# Altium project SVPXFMC_Carrier_3U.PrjPcb (part 2 of 7)

## Sheet FPGA_Misc.SchDoc: SVPXFMC Carrier 3U
size 420 x 297 mm; CheckedBy: \; Author: G.Kasprowicz; CompanyName: ISE; DrawnBy: T.Przywozki; Organization: WUT ISE; Address1: Warsaw University of Technology; Address2: Nowowiejska 15/19 00-665 Warsaw; Revision: 1.0.; SheetNumber: 18; SheetTotal: 20; Project: SVPXFMC Carrier 3U; ModifiedBy: -; CheckedDate: -; Title2: FPGA Misc; DivGrp: ISE; Designer: G. Kasprowicz
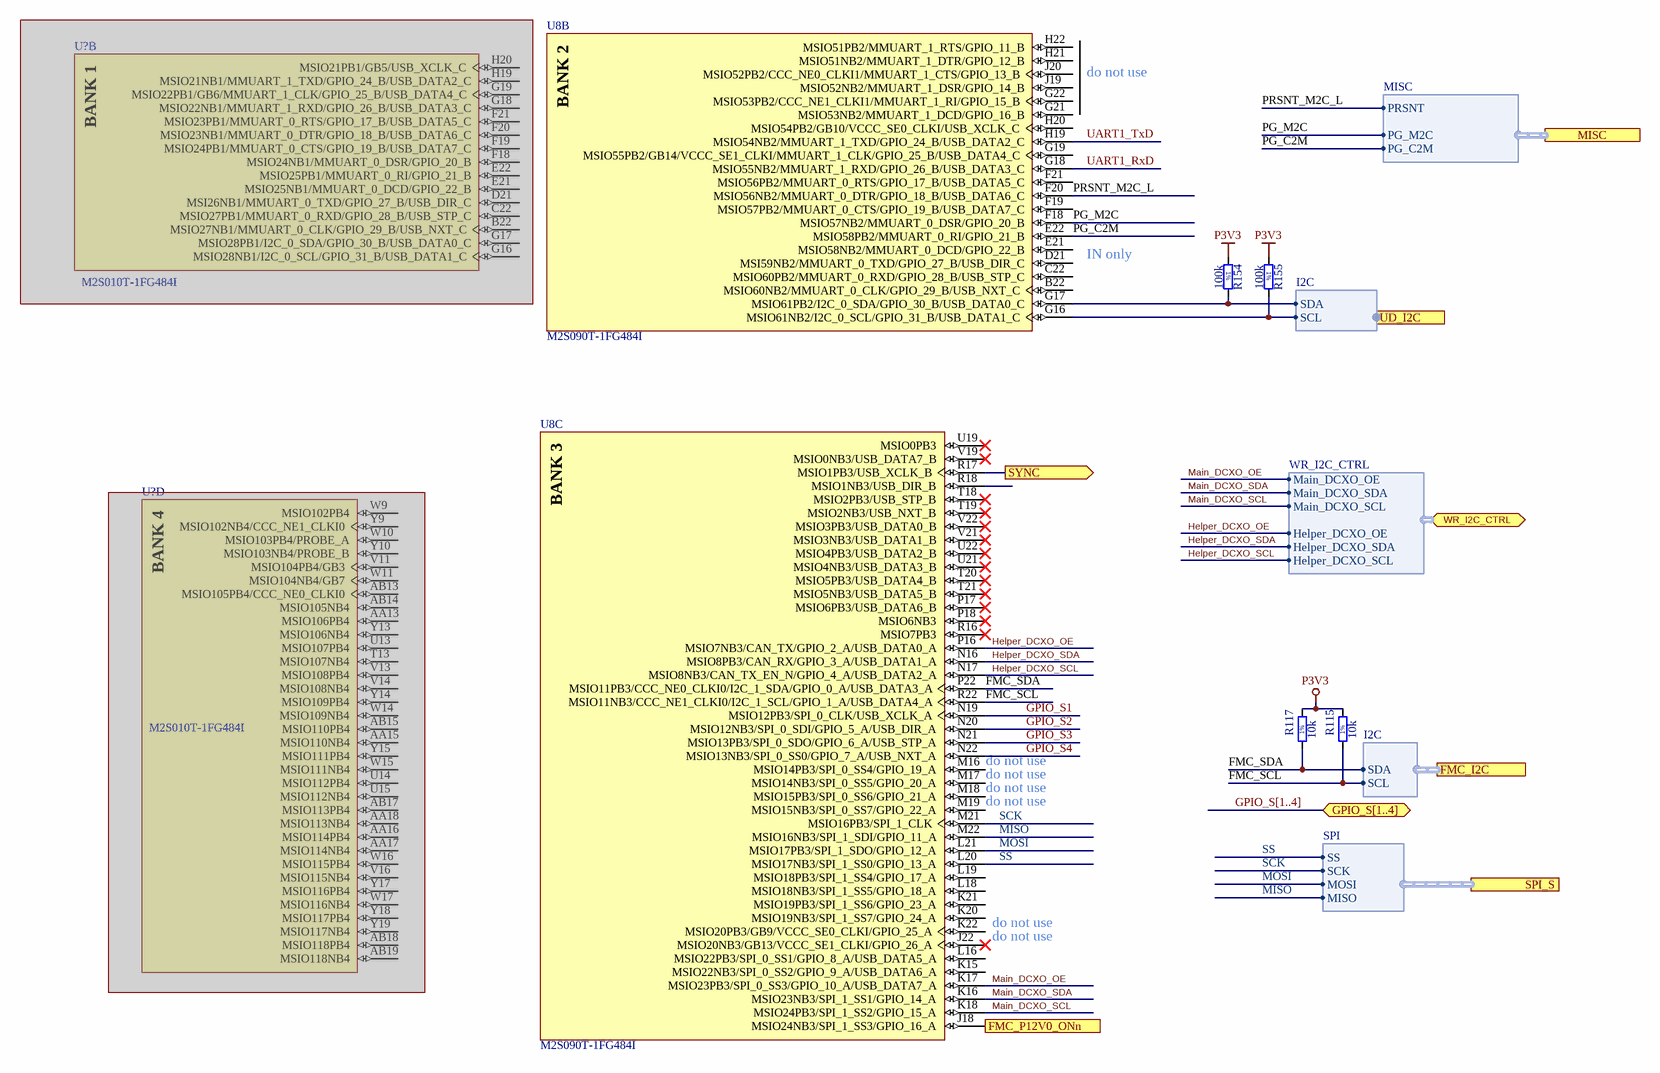
[diagram p4: FPGA_Misc.SchDoc]

### Parts
(Parts that share a designator on the sheet are numbered #1, #2 ... from top to bottom, then left to right.)
R115  10k  [RESC1005X40N]
R117  10k  [RESC1005X40N]
R154  100k  [RESC1005X40N]
R155  100k  [RESC1005X40N]
U8  M2S090T-1FG484I  [MCSM-FG-484_V]  (parts B,C of 15)
U?#3  M2S010T-1FG484I  [MCSM-FG-484_V]  (part B of 16)  (masked out: inside a compile mask, not in the netlist)
U?#4  M2S010T-1FG484I  [MCSM-FG-484_V]  (part D of 16)  (masked out: inside a compile mask, not in the netlist)

### Ports
FMC_I2C (harness I2C), FMC_P12V0_ONn (out), GPIO_S[1..4] (bidir), MISC (harness MISC), SPI_S (harness SPI), SYNC (out), UD_I2C (harness I2C), WR_I2C_CTRL (bidir, harness WR_I2C_CTRL)

### Harnesses
I2C: SCL, SDA
MISC: PRSNT, PG_M2C, PG_C2M
SPI: MISO, MOSI, SCK, SS
WR_I2C_CTRL: Main_DCXO_OE, Main_DCXO_SDA, Main_DCXO_SCL, Helper_DCXO_OE, Helper_DCXO_SDA, Helper_DCXO_SCL
I2C: SDA, SCL

### Nets
P3V3: R115.2 R117.2 R154.1 R155.1
FMC_P12V0_ONn: U8.J18(MSIO24NB3/SPI_1_SS3/GPIO_16_A) ; port FMC_P12V0_ONn
FMC_SCL: R115.1 U8.R22(MSIO11NB3/CCC_NE1_CLKI0/I2C_1_SCL/GPIO_1_A/USB_DATA4_A) ; port FMC_I2C.SCL
FMC_SDA: R117.1 U8.P22(MSIO11PB3/CCC_NE0_CLKI0/I2C_1_SDA/GPIO_0_A/USB_DATA3_A) ; port FMC_I2C.SDA
GPIO_S1: U8.N19(MSIO12PB3/SPI_0_CLK/USB_XCLK_A)
GPIO_S2: U8.N20(MSIO12NB3/SPI_0_SDI/GPIO_5_A/USB_DIR_A)
GPIO_S3: U8.N21(MSIO13PB3/SPI_0_SDO/GPIO_6_A/USB_STP_A)
GPIO_S4: U8.N22(MSIO13NB3/SPI_0_SS0/GPIO_7_A/USB_NXT_A)
Helper_DCXO_OE: U8.P16(MSIO7NB3/CAN_TX/GPIO_2_A/USB_DATA0_A) ; port WR_I2C_CTRL.Helper_DCXO_OE
Helper_DCXO_SCL: U8.N17(MSIO8NB3/CAN_TX_EN_N/GPIO_4_A/USB_DATA2_A) ; port WR_I2C_CTRL.Helper_DCXO_SCL
Helper_DCXO_SDA: U8.N16(MSIO8PB3/CAN_RX/GPIO_3_A/USB_DATA1_A) ; port WR_I2C_CTRL.Helper_DCXO_SDA
Main_DCXO_OE: U8.K17(MSIO23PB3/SPI_0_SS3/GPIO_10_A/USB_DATA7_A) ; port WR_I2C_CTRL.Main_DCXO_OE
Main_DCXO_SCL: U8.K18(MSIO24PB3/SPI_1_SS2/GPIO_15_A) ; port WR_I2C_CTRL.Main_DCXO_SCL
Main_DCXO_SDA: U8.K16(MSIO23NB3/SPI_1_SS1/GPIO_14_A) ; port WR_I2C_CTRL.Main_DCXO_SDA
MISO: U8.M22(MSIO16NB3/SPI_1_SDI/GPIO_11_A) ; port SPI_S.MISO
MOSI: U8.L21(MSIO17PB3/SPI_1_SDO/GPIO_12_A) ; port SPI_S.MOSI
PG_C2M: U8.E22(MSIO58PB2/MMUART_0_RI/GPIO_21_B) ; port MISC.PG_C2M
PG_M2C: U8.F18(MSIO57NB2/MMUART_0_DSR/GPIO_20_B) ; port MISC.PG_M2C
PRSNT_M2C_L: U8.F20(MSIO56NB2/MMUART_0_DTR/GPIO_18_B/USB_DATA6_C) ; port MISC.PRSNT
SCK: U8.M21(MSIO16PB3/SPI_1_CLK) ; port SPI_S.SCK
SS: U8.L20(MSIO17NB3/SPI_1_SS0/GPIO_13_A) ; port SPI_S.SS
SYNC: U8.R17(MSIO1PB3/USB_XCLK_B) ; port SYNC
UART1_RxD: U8.G18(MSIO55NB2/MMUART_1_RXD/GPIO_26_B/USB_DATA3_C)  [project net UART1_RxD_18]
UART1_TxD: U8.H19(MSIO54NB2/MMUART_1_TXD/GPIO_24_B/USB_DATA2_C)  [project net UART1_TxD_18]
NetR152_2: R154.2 U8.G17(MSIO61PB2/I2C_0_SDA/GPIO_30_B/USB_DATA0_C) ; port UD_I2C.SDA
NetR153_2: R155.2 U8.G16(MSIO61NB2/I2C_0_SCL/GPIO_31_B/USB_DATA1_C) ; port UD_I2C.SCL

Not connected (* = marked no-connect by the designer): U8 B22(MSIO60NB2/MMUART_0_CLK/GPIO_29_B/USB_NXT_C) C22(MSIO60PB2/MMUART_0_RXD/GPIO_28_B/USB_STP_C) D21(MSI59NB2/MMUART_0_TXD/GPIO_27_B/USB_DIR_C) E21(MSIO58NB2/MMUART_0_DCD/GPIO_22_B) F19(MSIO57PB2/MMUART_0_CTS/GPIO_19_B/USB_DATA7_C) F21(MSIO56PB2/MMUART_0_RTS/GPIO_17_B/USB_DATA5_C) G19(MSIO55PB2/GB14/VCCC_SE1_CLKI/MMUART_1_CLK/GPIO_25_B/USB_DATA4_C) G21(MSIO53NB2/MMUART_1_DCD/GPIO_16_B) G22(MSIO53PB2/CCC_NE1_CLKI1/MMUART_1_RI/GPIO_15_B) H20(MSIO54PB2/GB10/VCCC_SE0_CLKI/USB_XCLK_C) H21(MSIO51NB2/MMUART_1_DTR/GPIO_12_B) H22(MSIO51PB2/MMUART_1_RTS/GPIO_11_B) J19(MSIO52NB2/MMUART_1_DSR/GPIO_14_B) J20(MSIO52PB2/CCC_NE0_CLKI1/MMUART_1_CTS/GPIO_13_B) J22(MSIO20NB3/GB13/VCCC_SE1_CLKI/GPIO_26_A)* K15(MSIO22NB3/SPI_0_SS2/GPIO_9_A/USB_DATA6_A) K20(MSIO19NB3/SPI_1_SS7/GPIO_24_A) K21(MSIO19PB3/SPI_1_SS6/GPIO_23_A) K22(MSIO20PB3/GB9/VCCC_SE0_CLKI/GPIO_25_A) L16(MSIO22PB3/SPI_0_SS1/GPIO_8_A/USB_DATA5_A) L18(MSIO18NB3/SPI_1_SS5/GPIO_18_A) L19(MSIO18PB3/SPI_1_SS4/GPIO_17_A) M16(MSIO14PB3/SPI_0_SS4/GPIO_19_A) M17(MSIO14NB3/SPI_0_SS5/GPIO_20_A) M18(MSIO15PB3/SPI_0_SS6/GPIO_21_A) M19(MSIO15NB3/SPI_0_SS7/GPIO_22_A) P17(MSIO6PB3/USB_DATA6_B)* P18(MSIO6NB3)* R16(MSIO7PB3)* R18(MSIO1NB3/USB_DIR_B) T18(MSIO2PB3/USB_STP_B)* T19(MSIO2NB3/USB_NXT_B)* T20(MSIO5PB3/USB_DATA4_B)* T21(MSIO5NB3/USB_DATA5_B)* U19(MSIO0PB3)* U21(MSIO4NB3/USB_DATA3_B)* U22(MSIO4PB3/USB_DATA2_B)* V19(MSIO0NB3/USB_DATA7_B)* V21(MSIO3NB3/USB_DATA1_B)* V22(MSIO3PB3/USB_DATA0_B)*

### Buses and harness runs
bus GPIO_S[1..4] = port GPIO_S[1..4]

### Notes on the sheet
- do not use
- IN only
- (near U8) do not use
- Project/Equipment
- Document
- Designer
- Drawn by
- Check.by
- File
- Last Mod.
- Print Date
- Sheet
- Size
- A3
- of
- Rev
- Copyright WUT ISE 2019
  This documentation describes Open Hardware and is licensed under the CERN OHL v.1.1. You may redistribute and modify this documentation under the terms of the CERN OHL v1.1.
  (http://ohwr.org/CERNOHL). This documentation is dristributed WITHOUT ANY EXPRESS OR IMPLIED WARRANTY, INCLUDING OF MERCHANTABILITY, SATISFACTORY QUALITY AND FITNESS FOR A PARTICULAR PURPOSE. Please see the CERN OHL v.1.1 for applicable conditions
- (in symbol CMP-0959-00045-1, part B) BANK 2
- (in symbol CMP-0959-00045-1, part C) BANK 3
- (in symbol CMP-0959-00069-1, part B) BANK 1
- (in symbol CMP-0959-00069-1, part D) BANK 4
- (in symbol R0402_10K_1%_0.0625W_100PPM) 1%
- (in symbol R0402_100K_1%_0.0625W_100PPM) 1%

### Library data of the parts
R115 R117 = R0402_10K_1%_0.0625W_100PPM: Resistor - 1%; Manufacturer: GENERIC; Part Description: General Purpose Thick Film Chip Resistor; Manufacturer1 Part Number: 232270671003L; TC: ±100ppm/°C; PressFit: No; Manufacturer Part Number: R0402_10K_1%_0.0625W_100PPM; Part Number: R0402_10K_1%_0.0625W_100PPM; Tolerance: ±1%; Value: 10k; Component Kind: Standard; Component Type: Standard; Pin Count: 2; Status: Not Recommended; Power: 0.0625W; Case: 0402; Mounted: Yes; Sense: No; Socket: No; SMD: Yes; Manufacturer1 Example: YAGEO PHYCOMP; Manufacturer1 ComponentHeight: 0.4mm; HelpURL: \\cern.ch\dfs\Applications\Altium\Datasheets\R0402_Phycomp_RC0402.pdf; Author: CERN DEM JLC; CreateDate: 03/12/2007; LatestRevisionDate: 17/10/2012
R154 R155 = R0402_100K_1%_0.0625W_100PPM: Resistor - 1%; Part Description: General Purpose Thick Film Chip Resistor; Manufacturer: GENERIC; Manufacturer1 Part Number: 232270671004L; TC: ±100ppm/°C; PressFit: No; Part Number: R0402_100K_1%_0.0625W_100PPM; Component Kind: Standard; Component Type: Standard; Pin Count: 2; Value: 100k; Status: Not Recommended; Power: 0.0625W; Tolerance: ±1%; Manufacturer Part Number: R0402_100K_1%_0.0625W_100PPM; Case: 0402; Mounted: Yes; Sense: No; Socket: No; SMD: Yes; Manufacturer1 Example: YAGEO PHYCOMP; Manufacturer1 ComponentHeight: 0.4mm; HelpURL: \\cern.ch\dfs\Applications\Altium\Datasheets\R0402_Phycomp_RC0402.pdf; Author: CERN DEM JLC; CreateDate: 03.12.2007; LatestRevisionDate: 17.10.2012
U8 = CMP-0959-00045-1: SmartFusion2 SoC FPGA, ARM Cortex-M3, 90 K LUTs, 267 User I/O, Transceiver Available, Design Security, Speed Grade 1, -40 to 100 degC, 484-Ball BGA; Manufacturer: Microsemi; Total User I/O: 267; PLLs and CCCs: 6; LSRAM 18K Blocks: 109; eNVM (K Bytes): 512; DDR Controllers (Count x Width): 1x18; Math Blocks (18x18): 84; Maximum Logic Elements: 86,316; eSRAM (K Bytes): 64; MSIOD (2.5V): 40; SERDES Lanes: 4; MSIO (3.3V): 157; Total RAM (K bits): 2074; DDRIO (2.5V): 70; uSRAM1K Blocks: 112; eSRAM (K Bytes) Non SECDED: 80; ComponentLink3URL: http://www.microsemi.com/document-portal/doc_download/131095-package-mechanical-drawings; DatasheetVersion: Rev. 5; ComponentLink3Description: Package Specification; ComponentLink1Description: Manufacturer URL; PackageReference: FG-484; RoHS: FALSE; ComponentLink1URL: http://www.microsemi.com/; Code_JEDEC: MS-034; Mounting Technology: Surface Mount; PackageDescription: 484-Ball Fine Pitch Plastic Ball Grid Array (FBGA), Body 23 x 23 mm, Pitch 1 mm; PackageVersion: Rev. 48, 11/2013; ComponentLink2URL: http://www.microsemi.com/document-portal/doc_download/130717-smartfusion2-datasheet; PartNumber: M2S090T-1FG484I; ComponentLink2Description: Datasheet; PartId: 1
U?#3 U?#4 = CMP-0959-00069-1: SmartFusion2 SoC FPGA, ARM Cortex-M3, 10 K LUTs, 233 User I/O, Transceiver Available, Design Security, Speed Grade 1, -40 to 100 degC, 484-Ball BGA; Manufacturer: Microsemi; MSIO (3.3V): 123; DDRIO (2.5V): 70; eSRAM (K Bytes): 64; uSRAM1K Blocks: 22; SERDES Lanes: 4; DDR Controllers (Count x Width): 1x18; MSIOD (2.5V): 40; Maximum Logic Elements: 12,084; eNVM (K Bytes): 256; PLLs and CCCs: 2; LSRAM 18K Blocks: 21; eSRAM (K Bytes) Non SECDED: 80; Total RAM (K bits): 400; Total User I/O: 233; PackageVersion: Rev. 48, 11/2013; ComponentLink3URL: http://www.microsemi.com/document-portal/doc_download/131095-package-mechanical-drawings; ComponentLink1Description: Manufacturer URL; DatasheetVersion: Rev. 5; RoHS: FALSE; ComponentLink2Description: Datasheet; Code_JEDEC: MS-034; ComponentLink3Description: Package Specification; ComponentLink2URL: http://www.microsemi.com/document-portal/doc_download/130717-smartfusion2-datasheet; PartNumber: M2S010T-1FG484I; ComponentLink1URL: http://www.microsemi.com/; Math Blocks (18x18): 22; Mounting Technology: Surface Mount; PackageDescription: 484-Ball Fine Pitch Plastic Ball Grid Array (FBGA), Body 23 x 23 mm, Pitch 1 mm; PackageReference: FG-484

## Sheet FPGA_MGT.SchDoc: SVPXFMC Carrier 3U
size 420 x 297 mm; CheckedBy: \; Author: G.Kasprowicz; CompanyName: ISE; DrawnBy: T.Przywozki; Organization: WUT ISE; Address1: Warsaw University of Technology; Address2: Nowowiejska 15/19 00-665 Warsaw; Revision: 1.0.; SheetNumber: 9; SheetTotal: 20; Project: SVPXFMC Carrier 3U; ModifiedBy: -; CheckedDate: -; Title2: FPGA MGT; DivGrp: ISE; Designer: G. Kasprowicz
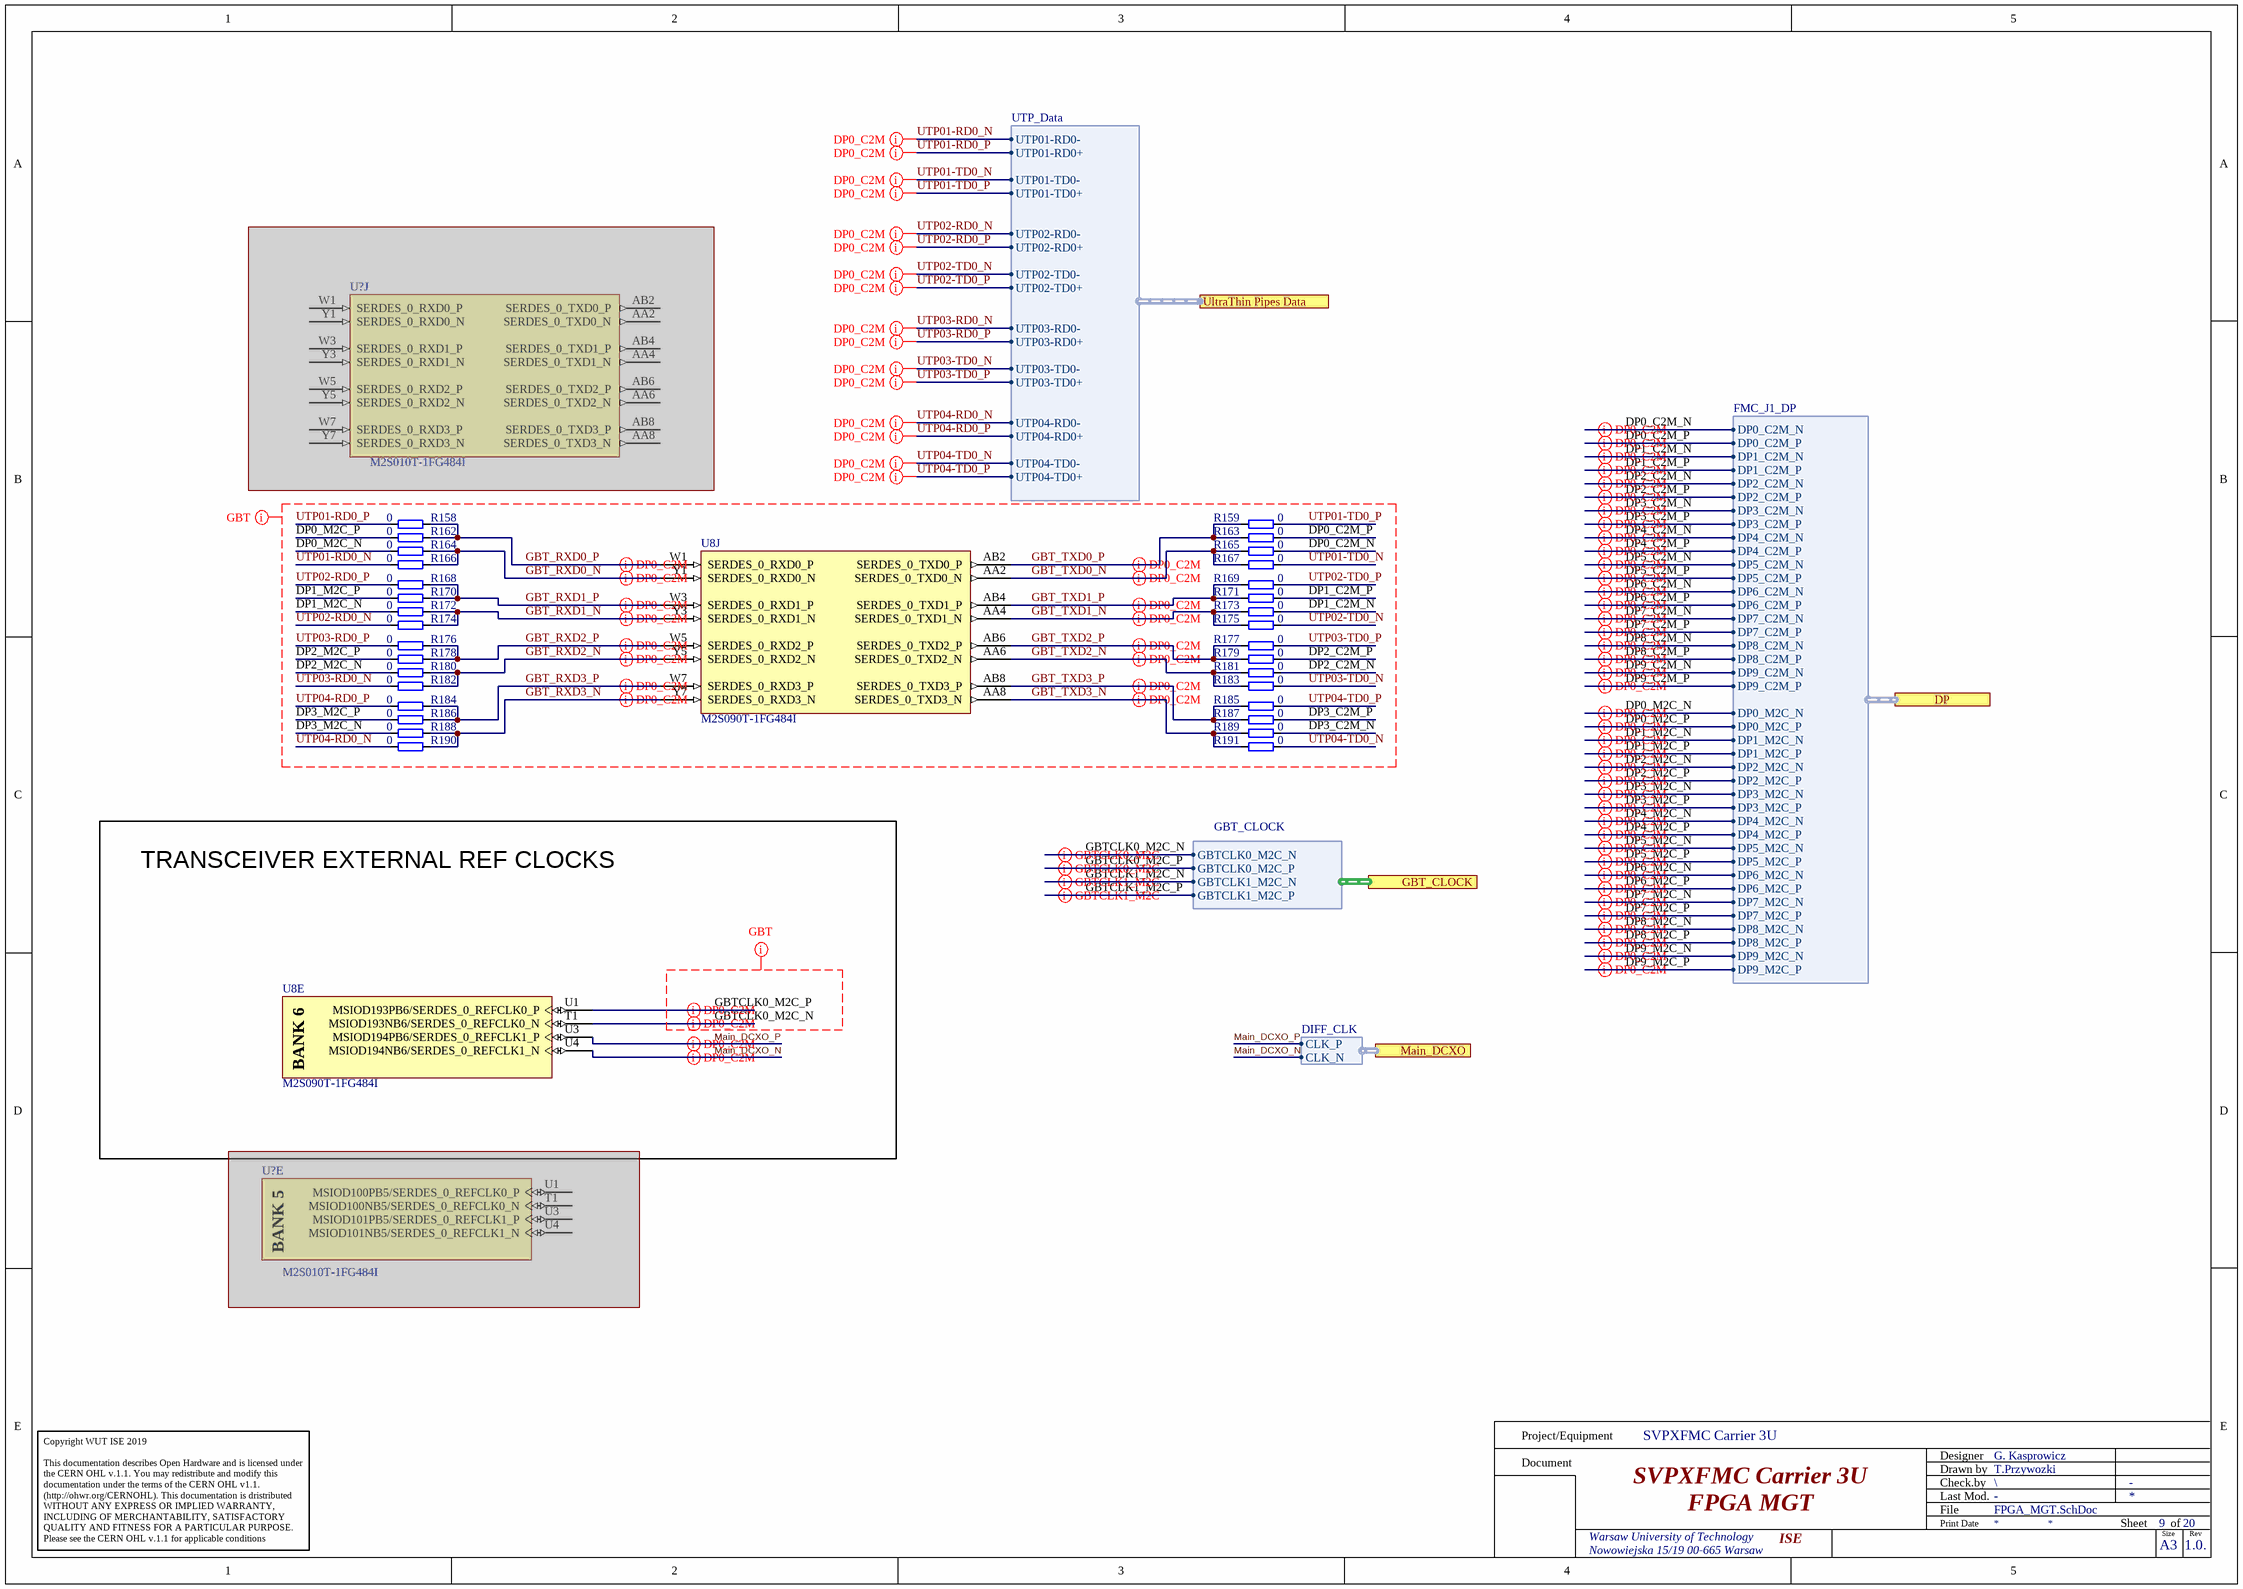
[diagram p5: FPGA_MGT.SchDoc]

### Parts
(Parts that share a designator on the sheet are numbered #1, #2 ... from top to bottom, then left to right.)
R158  0  [RESC0603X28N]
R159  0  [RESC0603X28N]
R162  0  [RESC0603X28N]
R163  0  [RESC0603X28N]
R164  0  [RESC0603X28N]
R165  0  [RESC0603X28N]
R166  0  [RESC0603X28N]
R167  0  [RESC0603X28N]
R168  0  [RESC0603X28N]
R169  0  [RESC0603X28N]
R170  0  [RESC0603X28N]
R171  0  [RESC0603X28N]
R172  0  [RESC0603X28N]
R173  0  [RESC0603X28N]
R174  0  [RESC0603X28N]
R175  0  [RESC0603X28N]
R176  0  [RESC0603X28N]
R177  0  [RESC0603X28N]
R178  0  [RESC0603X28N]
R179  0  [RESC0603X28N]
R180  0  [RESC0603X28N]
R181  0  [RESC0603X28N]
R182  0  [RESC0603X28N]
R183  0  [RESC0603X28N]
R184  0  [RESC0603X28N]
R185  0  [RESC0603X28N]
R186  0  [RESC0603X28N]
R187  0  [RESC0603X28N]
R188  0  [RESC0603X28N]
R189  0  [RESC0603X28N]
R190  0  [RESC0603X28N]
R191  0  [RESC0603X28N]
U8  M2S090T-1FG484I  [MCSM-FG-484_V]  (parts E,J of 15)
U?#5  M2S010T-1FG484I  [MCSM-FG-484_V]  (part J of 16)  (masked out: inside a compile mask, not in the netlist)
U?#6  M2S010T-1FG484I  [MCSM-FG-484_V]  (part E of 16)  (masked out: inside a compile mask, not in the netlist)

### Blocks framed on the sheet
TRANSCEIVER EXTERNAL REF CLOCKS: U8

### Ports
DP (harness FMC_J1_DP), GBT_CLOCK (harness GBT_CLOCK), Main_DCXO (harness DIFF_CLK), UltraThin Pipes Data (harness UTP_Data)

### Harnesses
FMC_J1_DP: DP1_C2M_N, DP1_C2M_P, DP1_M2C_N, DP1_M2C_P, DP2_C2M_N, DP2_C2M_P, DP2_M2C_N, DP2_M2C_P, DP3_C2M_N, DP3_C2M_P, DP3_M2C_N, DP3_M2C_P, DP0_C2M_N, DP0_C2M_P, DP0_M2C_N, DP0_M2C_P, DP4_C2M_N, DP4_C2M_P, DP5_C2M_N, DP5_C2M_P, DP6_C2M_N, DP6_C2M_P, DP7_C2M_N, DP7_C2M_P, DP8_C2M_N, DP8_C2M_P, DP9_C2M_N, DP9_C2M_P, DP4_M2C_N, DP4_M2C_P, DP5_M2C_N, DP5_M2C_P, DP6_M2C_N, DP6_M2C_P, DP7_M2C_N, DP7_M2C_P, DP8_M2C_N, DP8_M2C_P, DP9_M2C_N, DP9_M2C_P
GBT_CLOCK: GBTCLK0_M2C_N, GBTCLK0_M2C_P, GBTCLK1_M2C_N, GBTCLK1_M2C_P
DIFF_CLK: CLK_N, CLK_P
UTP_Data: UTP01-RD0-, UTP01-RD0+, UTP01-TD0-, UTP01-TD0+, UTP02-RD0-, UTP02-RD0+, UTP02-TD0-, UTP02-TD0+, UTP03-RD0-, UTP03-RD0+, UTP03-TD0-, UTP03-TD0+, UTP04-RD0-, UTP04-RD0+, UTP04-TD0-, UTP04-TD0+

### Nets
DP0_C2M_N: R165.2 ; port DP.DP0_C2M_N
DP0_C2M_P: R163.2 ; port DP.DP0_C2M_P
DP0_M2C_N: R164.2 ; port DP.DP0_M2C_N
DP0_M2C_P: R162.2 ; port DP.DP0_M2C_P
DP1_C2M_N: R173.2 ; port DP.DP1_C2M_N
DP1_C2M_P: R171.2 ; port DP.DP1_C2M_P
DP1_M2C_N: R172.2 ; port DP.DP1_M2C_N
DP1_M2C_P: R170.2 ; port DP.DP1_M2C_P
DP2_C2M_N: R181.2 ; port DP.DP2_C2M_N
DP2_C2M_P: R179.2 ; port DP.DP2_C2M_P
DP2_M2C_N: R180.2 ; port DP.DP2_M2C_N
DP2_M2C_P: R178.2 ; port DP.DP2_M2C_P
DP3_C2M_N: R189.2 ; port DP.DP3_C2M_N
DP3_C2M_P: R187.2 ; port DP.DP3_C2M_P
DP3_M2C_N: R188.2 ; port DP.DP3_M2C_N
DP3_M2C_P: R186.2 ; port DP.DP3_M2C_P
GBT_RXD0_N: R164.1 R166.1 U8.Y1(SERDES_0_RXD0_N)  [project net GBT_RXD0_N_9]
GBT_RXD0_P: R158.1 R162.1 U8.W1(SERDES_0_RXD0_P)  [project net GBT_RXD0_P_9]
GBT_RXD1_N: R172.1 R174.1 U8.Y3(SERDES_0_RXD1_N)  [project net GBT_RXD1_N_9]
GBT_RXD1_P: R168.1 R170.1 U8.W3(SERDES_0_RXD1_P)  [project net GBT_RXD1_P_9]
GBT_RXD2_N: R180.1 R182.1 U8.Y5(SERDES_0_RXD2_N)  [project net GBT_RXD2_N_9]
GBT_RXD2_P: R176.1 R178.1 U8.W5(SERDES_0_RXD2_P)  [project net GBT_RXD2_P_9]
GBT_RXD3_N: R188.1 R190.1 U8.Y7(SERDES_0_RXD3_N)  [project net GBT_RXD3_N_9]
GBT_RXD3_P: R184.1 R186.1 U8.W7(SERDES_0_RXD3_P)  [project net GBT_RXD3_P_9]
GBT_TXD0_N: R165.1 R167.1 U8.AA2(SERDES_0_TXD0_N)  [project net GBT_TXD0_N_9]
GBT_TXD0_P: R159.1 R163.1 U8.AB2(SERDES_0_TXD0_P)  [project net GBT_TXD0_P_9]
GBT_TXD1_N: R173.1 R175.1 U8.AA4(SERDES_0_TXD1_N)  [project net GBT_TXD1_N_9]
GBT_TXD1_P: R169.1 R171.1 U8.AB4(SERDES_0_TXD1_P)  [project net GBT_TXD1_P_9]
GBT_TXD2_N: R181.1 R183.1 U8.AA6(SERDES_0_TXD2_N)  [project net GBT_TXD2_N_9]
GBT_TXD2_P: R177.1 R179.1 U8.AB6(SERDES_0_TXD2_P)  [project net GBT_TXD2_P_9]
GBT_TXD3_N: R189.1 R191.1 U8.AA8(SERDES_0_TXD3_N)  [project net GBT_TXD3_N_9]
GBT_TXD3_P: R185.1 R187.1 U8.AB8(SERDES_0_TXD3_P)  [project net GBT_TXD3_P_9]
GBTCLK0_M2C_N: U8.T1(MSIOD193NB6/SERDES_0_REFCLK0_N) ; port GBT_CLOCK.GBTCLK0_M2C_N
GBTCLK0_M2C_P: U8.U1(MSIOD193PB6/SERDES_0_REFCLK0_P) ; port GBT_CLOCK.GBTCLK0_M2C_P
Main_DCXO_N: U8.U4(MSIOD194NB6/SERDES_0_REFCLK1_N) ; port Main_DCXO.CLK_N
Main_DCXO_P: U8.U3(MSIOD194PB6/SERDES_0_REFCLK1_P) ; port Main_DCXO.CLK_P
UTP01-RD0_N: R166.2 ; port UltraThin Pipes Data.UTP01-RD0-
UTP01-RD0_P: R158.2 ; port UltraThin Pipes Data.UTP01-RD0+
UTP01-TD0_N: R167.2 ; port UltraThin Pipes Data.UTP01-TD0-
UTP01-TD0_P: R159.2 ; port UltraThin Pipes Data.UTP01-TD0+
UTP02-RD0_N: R174.2 ; port UltraThin Pipes Data.UTP02-RD0-
UTP02-RD0_P: R168.2 ; port UltraThin Pipes Data.UTP02-RD0+
UTP02-TD0_N: R175.2 ; port UltraThin Pipes Data.UTP02-TD0-
UTP02-TD0_P: R169.2 ; port UltraThin Pipes Data.UTP02-TD0+
UTP03-RD0_N: R182.2 ; port UltraThin Pipes Data.UTP03-RD0-
UTP03-RD0_P: R176.2 ; port UltraThin Pipes Data.UTP03-RD0+
UTP03-TD0_N: R183.2 ; port UltraThin Pipes Data.UTP03-TD0-
UTP03-TD0_P: R177.2 ; port UltraThin Pipes Data.UTP03-TD0+
UTP04-RD0_N: R190.2 ; port UltraThin Pipes Data.UTP04-RD0-
UTP04-RD0_P: R184.2 ; port UltraThin Pipes Data.UTP04-RD0+
UTP04-TD0_N: R191.2 ; port UltraThin Pipes Data.UTP04-TD0-
UTP04-TD0_P: R185.2 ; port UltraThin Pipes Data.UTP04-TD0+

### Layout directives
differential pair: GBTCLK0_M2C_N, GBTCLK0_M2C_P, GBTCLK1_M2C_N, GBTCLK1_M2C_P, Main_DCXO_N, Main_DCXO_P
differential pair; differential pair class GBT: DP0_C2M_N, DP0_C2M_P, DP0_M2C_N, DP0_M2C_P, DP1_C2M_N, DP1_C2M_P, DP1_M2C_N, DP1_M2C_P, DP2_C2M_N, DP2_C2M_P, DP2_M2C_N, DP2_M2C_P, DP3_C2M_N, DP3_C2M_P, DP3_M2C_N, DP3_M2C_P, DP4_C2M_N, DP4_C2M_P, DP4_M2C_N, DP4_M2C_P, DP5_C2M_N, DP5_C2M_P, DP5_M2C_N, DP5_M2C_P, DP6_C2M_N, DP6_C2M_P, DP6_M2C_N, DP6_M2C_P, DP7_C2M_N, DP7_C2M_P, DP7_M2C_N, DP7_M2C_P, DP8_C2M_N, DP8_C2M_P, DP8_M2C_N, DP8_M2C_P, DP9_C2M_N, DP9_C2M_P, DP9_M2C_N, DP9_M2C_P, GBT_RXD0_N_9, GBT_RXD0_P_9, GBT_RXD1_N_9, GBT_RXD1_P_9, GBT_RXD2_N_9, GBT_RXD2_P_9, GBT_RXD3_N_9, GBT_RXD3_P_9, GBT_TXD0_N_9, GBT_TXD0_P_9, GBT_TXD1_N_9, GBT_TXD1_P_9, GBT_TXD2_N_9, GBT_TXD2_P_9, GBT_TXD3_N_9, GBT_TXD3_P_9, GBTCLK0_M2C_N, GBTCLK0_M2C_P, UTP01-RD0_N, UTP01-RD0_P, UTP01-TD0_N, UTP01-TD0_P, UTP02-RD0_N, UTP02-RD0_P, UTP02-TD0_N, UTP02-TD0_P, UTP03-RD0_N, UTP03-RD0_P, UTP03-TD0_N, UTP03-TD0_P, UTP04-RD0_N, UTP04-RD0_P, UTP04-TD0_N, UTP04-TD0_P
net class GBT: DP0_C2M_N, DP0_C2M_P, DP0_M2C_N, DP0_M2C_P, DP1_C2M_N, DP1_C2M_P, DP1_M2C_N, DP1_M2C_P, DP2_C2M_N, DP2_C2M_P, DP2_M2C_N, DP2_M2C_P, DP3_C2M_N, DP3_C2M_P, DP3_M2C_N, DP3_M2C_P, GBT_RXD0_N, GBT_RXD0_P, GBT_RXD1_N, GBT_RXD1_P, GBT_RXD2_N, GBT_RXD2_P, GBT_RXD3_N, GBT_RXD3_P, GBT_TXD0_N, GBT_TXD0_P, GBT_TXD1_N, GBT_TXD1_P, GBT_TXD2_N, GBT_TXD2_P, GBT_TXD3_N, GBT_TXD3_P, GBTCLK0_M2C_N, GBTCLK0_M2C_P, UTP01-RD0_N, UTP01-RD0_P, UTP01-TD0_N, UTP01-TD0_P, UTP02-RD0_N, UTP02-RD0_P, UTP02-TD0_N, UTP02-TD0_P, UTP03-RD0_N, UTP03-RD0_P, UTP03-TD0_N, UTP03-TD0_P, UTP04-RD0_N, UTP04-RD0_P, UTP04-TD0_N, UTP04-TD0_P

### Notes on the sheet
- Project/Equipment
- Document
- Designer
- Drawn by
- Check.by
- File
- Last Mod.
- Print Date
- Sheet
- Size
- A3
- of
- Rev
- Copyright WUT ISE 2019
  This documentation describes Open Hardware and is licensed under the CERN OHL v.1.1. You may redistribute and modify this documentation under the terms of the CERN OHL v1.1.
  (http://ohwr.org/CERNOHL). This documentation is dristributed WITHOUT ANY EXPRESS OR IMPLIED WARRANTY, INCLUDING OF MERCHANTABILITY, SATISFACTORY QUALITY AND FITNESS FOR A PARTICULAR PURPOSE. Please see the CERN OHL v.1.1 for applicable conditions
- (in symbol CMP-0959-00045-1, part E) BANK 6
- (in symbol CMP-0959-00069-1, part E) BANK 5

### Library data of the parts
R158 R159 R162-R191 = R0201_0R_JUMPER: Resistor; Part Description: 1A (0.05R Max DC Resistance) Zero Ohm Jumper; Manufacturer: GENERIC; Manufacturer1 Part Number: CRCW02010000Z0ED; PressFit: No; Part Number: R0201_0R_JUMPER; Component Kind: Standard; Component Type: Standard; Pin Count: 2; Value: 0; Status: Not Recommended; Manufacturer Part Number: R0201_0R_JUMPER; Case: 0201; Mounted: Yes; Sense: No; Socket: No; SMD: Yes; Manufacturer1 Example: VISHAY; Manufacturer1 ComponentHeight: 0.27mm; HelpURL: \\cern.ch\dfs\Applications\Altium\Datasheets\R0201_VISHAY_CRCW e3.pdf; Author: CERN DEM JLC; CreateDate: 19.11.2014; LatestRevisionDate: 08.01.2015
U8 = CMP-0959-00045-1: as U8 on sheet FPGA_Misc; ComponentLink3URL: http://www.microsemi.com/document-portal/doc_download/131095-package-mechanical-drawings; DatasheetVersion: Rev. 5; ComponentLink3Description: Package Specification; ComponentLink1Description: Manufacturer URL; PackageReference: FG-484; RoHS: FALSE; ComponentLink1URL: http://www.microsemi.com/; Code_JEDEC: MS-034; Mounting Technology: Surface Mount; PackageDescription: 484-Ball Fine Pitch Plastic Ball Grid Array (FBGA), Body 23 x 23 mm, Pitch 1 mm; PackageVersion: Rev. 48, 11/2013; ComponentLink2URL: http://www.microsemi.com/document-portal/doc_download/130717-smartfusion2-datasheet; PartNumber: M2S090T-1FG484I; ComponentLink2Description: Datasheet; PartId: 1
U?#5 U?#6 = CMP-0959-00069-1: as U?#3 on sheet FPGA_Misc; PackageVersion: Rev. 48, 11/2013; ComponentLink3URL: http://www.microsemi.com/document-portal/doc_download/131095-package-mechanical-drawings; ComponentLink1Description: Manufacturer URL; DatasheetVersion: Rev. 5; RoHS: FALSE; ComponentLink2Description: Datasheet; Code_JEDEC: MS-034; ComponentLink3Description: Package Specification; ComponentLink2URL: http://www.microsemi.com/document-portal/doc_download/130717-smartfusion2-datasheet; PartNumber: M2S010T-1FG484I; ComponentLink1URL: http://www.microsemi.com/; Math Blocks (18x18): 22; Mounting Technology: Surface Mount; PackageDescription: 484-Ball Fine Pitch Plastic Ball Grid Array (FBGA), Body 23 x 23 mm, Pitch 1 mm; PackageReference: FG-484